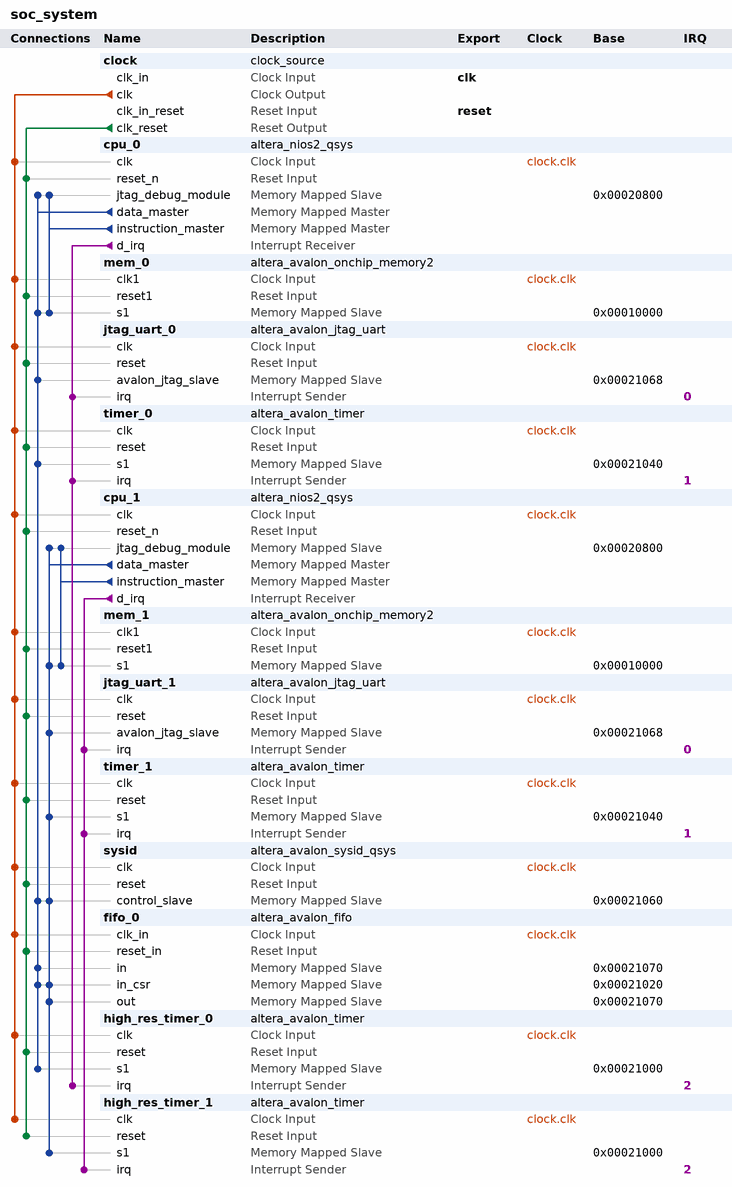
[diagram p0: system contents]
# Platform Designer (Qsys) system soc_system, Cyclone IV E EP4CE115F29C7
# Parameters at their usual value, and those the tool derives, are not listed.
package require -exact qsys 13.1
create_system soc_system
set_project_property DEVICE_FAMILY {Cyclone IV E}
set_project_property DEVICE EP4CE115F29C7

add_instance clock clock_source 13.1
set_instance_parameter_value clock clockFrequency 50000000

add_instance cpu_0 altera_nios2_qsys 13.1
set_instance_parameter_value cpu_0 resetSlave mem_0.s1
set_instance_parameter_value cpu_0 mmu_TLBMissExcSlave None
set_instance_parameter_value cpu_0 exceptionSlave mem_0.s1
set_instance_parameter_value cpu_0 breakSlave cpu_0.jtag_debug_module
set_instance_parameter_value cpu_0 impl Tiny
set_instance_parameter_value cpu_0 icache_size 4096

add_instance mem_0 altera_avalon_onchip_memory2 13.1
set_instance_parameter_value mem_0 dataWidth 32
set_instance_parameter_value mem_0 dualPort false
set_instance_parameter_value mem_0 initMemContent true
set_instance_parameter_value mem_0 initializationFileName onchip_mem.hex
set_instance_parameter_value mem_0 memorySize 40960

add_instance jtag_uart_0 altera_avalon_jtag_uart 13.1
set_instance_parameter_value jtag_uart_0 simInteractiveOptions NO_INTERACTIVE_WINDOWS

add_instance timer_0 altera_avalon_timer 13.1
set_instance_parameter_value timer_0 period 1
set_instance_parameter_value timer_0 periodUnits MSEC

add_instance cpu_1 altera_nios2_qsys 13.1
set_instance_parameter_value cpu_1 resetSlave mem_1.s1
set_instance_parameter_value cpu_1 mmu_TLBMissExcSlave None
set_instance_parameter_value cpu_1 exceptionSlave mem_1.s1
set_instance_parameter_value cpu_1 breakSlave cpu_1.jtag_debug_module
set_instance_parameter_value cpu_1 impl Tiny
set_instance_parameter_value cpu_1 icache_size 4096

add_instance mem_1 altera_avalon_onchip_memory2 13.1
set_instance_parameter_value mem_1 dataWidth 32
set_instance_parameter_value mem_1 dualPort false
set_instance_parameter_value mem_1 initMemContent true
set_instance_parameter_value mem_1 initializationFileName onchip_mem.hex
set_instance_parameter_value mem_1 memorySize 40960

add_instance jtag_uart_1 altera_avalon_jtag_uart 13.1
set_instance_parameter_value jtag_uart_1 simInteractiveOptions NO_INTERACTIVE_WINDOWS

add_instance timer_1 altera_avalon_timer 13.1
set_instance_parameter_value timer_1 period 1
set_instance_parameter_value timer_1 periodUnits MSEC

add_instance sysid altera_avalon_sysid_qsys 13.1
set_instance_parameter_value sysid id 0

add_instance fifo_0 altera_avalon_fifo 13.1
set_instance_parameter_value fifo_0 bitsPerSymbol 16
set_instance_parameter_value fifo_0 channelWidth 8
set_instance_parameter_value fifo_0 errorWidth 8
set_instance_parameter_value fifo_0 fifoDepth 16
set_instance_parameter_value fifo_0 fifoInputInterfaceOptions AVALONMM_WRITE
set_instance_parameter_value fifo_0 fifoOutputInterfaceOptions AVALONMM_READ
set_instance_parameter_value fifo_0 singleClockMode true
set_instance_parameter_value fifo_0 symbolsPerBeat 2
set_instance_parameter_value fifo_0 useIRQ true
set_instance_parameter_value fifo_0 usePacket true
set_instance_parameter_value fifo_0 useReadControl false

add_instance high_res_timer_0 altera_avalon_timer 13.1
set_instance_parameter_value high_res_timer_0 period 1
set_instance_parameter_value high_res_timer_0 periodUnits USEC

add_instance high_res_timer_1 altera_avalon_timer 13.1
set_instance_parameter_value high_res_timer_1 period 1
set_instance_parameter_value high_res_timer_1 periodUnits USEC

# connections
add_connection clock.clk cpu_0.clk clock
add_connection clock.clk cpu_1.clk clock
add_connection clock.clk fifo_0.clk_in clock
add_connection clock.clk high_res_timer_0.clk clock
add_connection clock.clk high_res_timer_1.clk clock
add_connection clock.clk jtag_uart_0.clk clock
add_connection clock.clk jtag_uart_1.clk clock
add_connection clock.clk mem_0.clk1 clock
add_connection clock.clk mem_1.clk1 clock
add_connection clock.clk sysid.clk clock
add_connection clock.clk timer_0.clk clock
add_connection clock.clk timer_1.clk clock
add_connection clock.clk_reset cpu_0.reset_n reset
add_connection clock.clk_reset cpu_1.reset_n reset
add_connection clock.clk_reset fifo_0.reset_in reset
add_connection clock.clk_reset high_res_timer_0.reset reset
add_connection clock.clk_reset high_res_timer_1.reset reset
add_connection clock.clk_reset jtag_uart_0.reset reset
add_connection clock.clk_reset jtag_uart_1.reset reset
add_connection clock.clk_reset mem_0.reset1 reset
add_connection clock.clk_reset mem_1.reset1 reset
add_connection clock.clk_reset sysid.reset reset
add_connection clock.clk_reset timer_0.reset reset
add_connection clock.clk_reset timer_1.reset reset
add_connection cpu_0.data_master cpu_0.jtag_debug_module avalon
set_connection_parameter_value cpu_0.data_master/cpu_0.jtag_debug_module baseAddress 0x00020800
add_connection cpu_0.data_master fifo_0.in avalon
set_connection_parameter_value cpu_0.data_master/fifo_0.in baseAddress 0x00021070
add_connection cpu_0.data_master fifo_0.in_csr avalon
set_connection_parameter_value cpu_0.data_master/fifo_0.in_csr baseAddress 0x00021020
add_connection cpu_0.data_master high_res_timer_0.s1 avalon
set_connection_parameter_value cpu_0.data_master/high_res_timer_0.s1 baseAddress 0x00021000
add_connection cpu_0.data_master jtag_uart_0.avalon_jtag_slave avalon
set_connection_parameter_value cpu_0.data_master/jtag_uart_0.avalon_jtag_slave baseAddress 0x00021068
add_connection cpu_0.data_master mem_0.s1 avalon
set_connection_parameter_value cpu_0.data_master/mem_0.s1 baseAddress 0x00010000
add_connection cpu_0.data_master sysid.control_slave avalon
set_connection_parameter_value cpu_0.data_master/sysid.control_slave baseAddress 0x00021060
add_connection cpu_0.data_master timer_0.s1 avalon
set_connection_parameter_value cpu_0.data_master/timer_0.s1 baseAddress 0x00021040
add_connection cpu_0.instruction_master cpu_0.jtag_debug_module avalon
set_connection_parameter_value cpu_0.instruction_master/cpu_0.jtag_debug_module baseAddress 0x00020800
add_connection cpu_0.instruction_master mem_0.s1 avalon
set_connection_parameter_value cpu_0.instruction_master/mem_0.s1 baseAddress 0x00010000
add_connection cpu_1.data_master cpu_1.jtag_debug_module avalon
set_connection_parameter_value cpu_1.data_master/cpu_1.jtag_debug_module baseAddress 0x00020800
add_connection cpu_1.data_master fifo_0.in_csr avalon
set_connection_parameter_value cpu_1.data_master/fifo_0.in_csr baseAddress 0x00021020
add_connection cpu_1.data_master fifo_0.out avalon
set_connection_parameter_value cpu_1.data_master/fifo_0.out baseAddress 0x00021070
add_connection cpu_1.data_master high_res_timer_1.s1 avalon
set_connection_parameter_value cpu_1.data_master/high_res_timer_1.s1 baseAddress 0x00021000
add_connection cpu_1.data_master jtag_uart_1.avalon_jtag_slave avalon
set_connection_parameter_value cpu_1.data_master/jtag_uart_1.avalon_jtag_slave baseAddress 0x00021068
add_connection cpu_1.data_master mem_1.s1 avalon
set_connection_parameter_value cpu_1.data_master/mem_1.s1 baseAddress 0x00010000
add_connection cpu_1.data_master sysid.control_slave avalon
set_connection_parameter_value cpu_1.data_master/sysid.control_slave baseAddress 0x00021060
add_connection cpu_1.data_master timer_1.s1 avalon
set_connection_parameter_value cpu_1.data_master/timer_1.s1 baseAddress 0x00021040
add_connection cpu_1.instruction_master cpu_1.jtag_debug_module avalon
set_connection_parameter_value cpu_1.instruction_master/cpu_1.jtag_debug_module baseAddress 0x00020800
add_connection cpu_1.instruction_master mem_1.s1 avalon
set_connection_parameter_value cpu_1.instruction_master/mem_1.s1 baseAddress 0x00010000
add_connection cpu_0.d_irq high_res_timer_0.irq interrupt
set_connection_parameter_value cpu_0.d_irq/high_res_timer_0.irq irqNumber 2
add_connection cpu_0.d_irq jtag_uart_0.irq interrupt
set_connection_parameter_value cpu_0.d_irq/jtag_uart_0.irq irqNumber 0
add_connection cpu_0.d_irq timer_0.irq interrupt
set_connection_parameter_value cpu_0.d_irq/timer_0.irq irqNumber 1
add_connection cpu_1.d_irq high_res_timer_1.irq interrupt
set_connection_parameter_value cpu_1.d_irq/high_res_timer_1.irq irqNumber 2
add_connection cpu_1.d_irq jtag_uart_1.irq interrupt
set_connection_parameter_value cpu_1.d_irq/jtag_uart_1.irq irqNumber 0
add_connection cpu_1.d_irq timer_1.irq interrupt
set_connection_parameter_value cpu_1.d_irq/timer_1.irq irqNumber 1

# exported interfaces
add_interface clk clock sink
set_interface_property clk EXPORT_OF clock.clk_in
add_interface reset reset sink
set_interface_property reset EXPORT_OF clock.clk_in_reset

set_interconnect_requirement {$system} qsys_mm.clockCrossingAdapter HANDSHAKE
set_interconnect_requirement {$system} qsys_mm.maxAdditionalLatency 1
set_interconnect_requirement {$system} qsys_mm.insertDefaultSlave false

save_system soc_system.qsys
